# Altium schematic sheet 固定翼.SchDoc
size A4
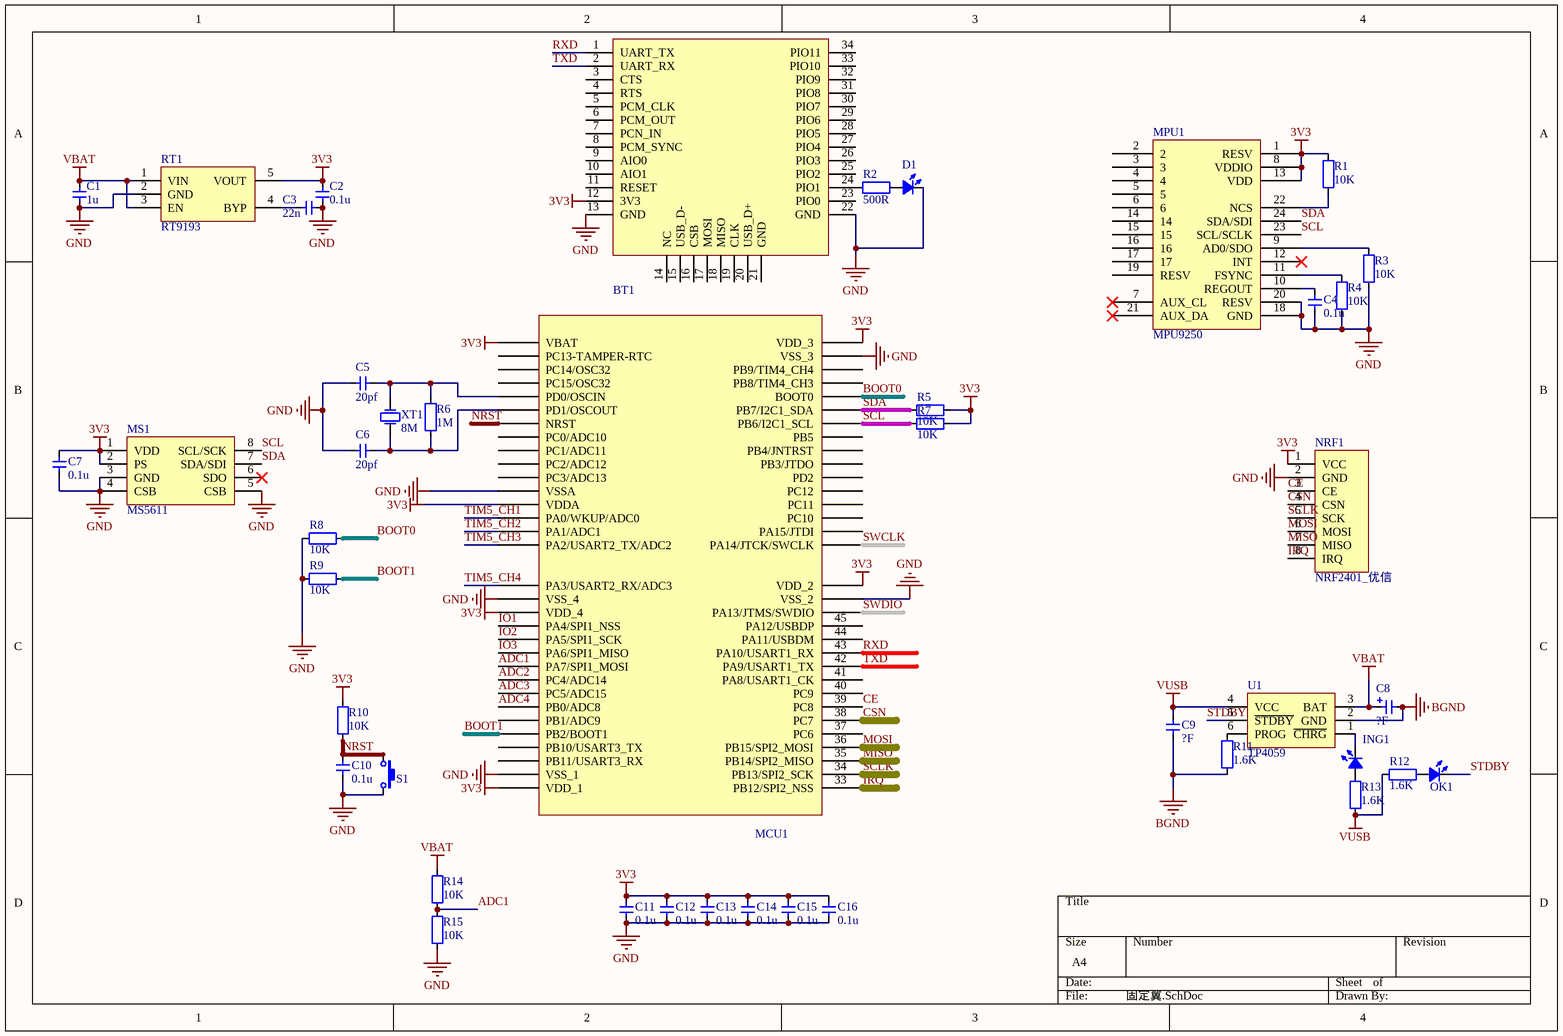
[diagram p0: 固定翼.SchDoc]

## Parts
BT1  Bluetooth_HC05  [Bluetooth_HC05]  (value not drawn)
C1  value 1u  [CAP_0603]  (hidden comment: Cap_0603)
C2  value 0.1u  [CAP_0603]  (hidden comment: Cap_0603)
C3  value 22n  [CAP_0603]  (hidden comment: Cap_0603)
C4  value 0.1u  [CAP_0603]  (hidden comment: Cap_0603)
C5  value 20pf  [CAP_0603]  (hidden comment: Cap_0603)
C6  value 20pf  [CAP_0603]  (hidden comment: Cap_0603)
C7  value 0.1u  [CAP_0603]  (hidden comment: Cap_0603)
C8  value ?F  [CAP_TAN_D2917]  (hidden comment: Cap_Tan_2917)
C9  value ?F  [CAP_0805]  (hidden comment: Cap_0805)
C10  value 0.1u  [CAP_0603]  (hidden comment: Cap_0603)
C11  value 0.1u  [CAP_0603]  (hidden comment: Cap_0603)
C12  value 0.1u  [CAP_0603]  (hidden comment: Cap_0603)
C13  value 0.1u  [CAP_0603]  (hidden comment: Cap_0603)
C14  value 0.1u  [CAP_0603]  (hidden comment: Cap_0603)
C15  value 0.1u  [CAP_0603]  (hidden comment: Cap_0603)
C16  value 0.1u  [CAP_0603]  (hidden comment: Cap_0603)
D1  LED_0805  [LED_0805_BLUE]  (value not drawn)
ING1  LED_0805  [LED_0805_RED]  (value not drawn)
MCU1  STM32F103RC  [LQFP_P0.5_64]  (value not drawn)
MPU1  MPU9250  [QFN_P0.4_24]
MS1  MS5611  [OTHER_MS5611_8]
NRF1  NRF2401_优信  [nrf24l01_youxin]
OK1  LED_0805  [LED_0805_GREEN]  (value not drawn)
R1  value 10K  [RES_0603]  (hidden comment: Res_0603)
R2  value 500R  [RES_0603]  (hidden comment: Res_0603)
R3  value 10K  [RES_0603]  (hidden comment: Res_0603)
R4  value 10K  [RES_0603]  (hidden comment: Res_0603)
R5  value 10K  [RES_0603]  (hidden comment: Res_0603)
R6  value 1M  [RES_0603]  (hidden comment: Res_0603)
R7  value 10K  [RES_0603]  (hidden comment: Res_0603)
R8  value 10K  [RES_0603]  (hidden comment: Res_0603)
R9  value 10K  [RES_0603]  (hidden comment: Res_0603)
R10  value 10K  [RES_0603]  (hidden comment: Res_0603)
R11  value 1.6K  [RES_0603]  (hidden comment: Res_0603)
R12  value 1.6K  [RES_0603]  (hidden comment: Res_0603)
R13  value 1.6K  [RES_0603]  (hidden comment: Res_0603)
R14  value 10K  [RES_0603]  (hidden comment: Res_0603)
R15  value 10K  [RES_0603]  (hidden comment: Res_0603)
RT1  RT9193  [SOT23-5]
S1  ButtonTACT_3x4x2_180  [ButtonTACT_3x4x2_180H]  (value not drawn)
U1  TP4059  [SOT23-6]
XT1  value 8M  [XT_5032_2]  (hidden comment: XTAL_5032_2P)

## Nets
3V3: BT1.12(3V3) C2.2 C7.2 C11.2 C12.2 C13.2 C14.2 C15.2 C16.2 MCU1.1(VBAT) MCU1.13(VDDA) MCU1.19(VDD_4) MCU1.32(VDD_1) MCU1.48(VDD_2) MCU1.64(VDD_3) MPU1.1(RESV) MPU1.8(VDDIO) MPU1.13(VDD) MS1.1(VDD) MS1.2(PS) NRF1.1(VCC) R1.1 R5.2 R7.2 R10.1 RT1.5(VOUT)
BGND: C8.2 C9.1 R11.2 U1.2(GND)
GND: BT1.13(GND) BT1.22(GND) C1.1 C2.1 C3.1 C4.2 C5.1 C6.1 C7.1 C10.1 C11.1 C12.1 C13.1 C14.1 C15.1 C16.1 D1.2(K) MCU1.12(VSSA) MCU1.18(VSS_4) MCU1.31(VSS_1) MCU1.47(VSS_2) MCU1.63(VSS_3) MPU1.18(GND) MPU1.20(RESV) MS1.3(GND) MS1.4(CSB) MS1.5(CSB) NRF1.2(GND) R3.2 R4.2 R8.2 R9.2 R15.1 RT1.2(GND) S1.2
VBAT: C1.2 C8.1 R14.2 RT1.1(VIN) RT1.3(EN) U1.3(BAT)
VUSB: C9.2 R12.1 R13.2 U1.4(VCC)
ADC1: MCU1.23(PA7/SPI1_MOSI) R14.1 R15.2
ADC2: MCU1.24(PC4/ADC14)
ADC3: MCU1.25(PC5/ADC15)
ADC4: MCU1.26(PB0/ADC8)
BOOT0: MCU1.60(BOOT0) R8.1
BOOT1: MCU1.28(PB2/BOOT1) R9.1
CE: MCU1.39(PC8) NRF1.3(CE)
CSN: MCU1.38(PC7) NRF1.4(CSN)
IO1: MCU1.20(PA4/SPI1_NSS)
IO2: MCU1.21(PA5/SPI1_SCK)
IO3: MCU1.22(PA6/SPI1_MISO)
IRQ: MCU1.33(PB12/SPI2_NSS) NRF1.8(IRQ)
MISO: MCU1.35(PB14/SPI2_MISO) NRF1.7(MISO)
MOSI: MCU1.36(PB15/SPI2_MOSI) NRF1.6(MOSI)
NRST: C10.2 MCU1.7(NRST) R10.2 S1.1
RXD: BT1.1(UART_TX) MCU1.43(PA10/USART1_RX)
SCL: MCU1.58(PB6/I2C1_SCL) MPU1.23(SCL/SCLK) MS1.8(SCL/SCK) R7.1
SCLK: MCU1.34(PB13/SPI2_SCK) NRF1.5(SCK)
SDA: MCU1.59(PB7/I2C1_SDA) MPU1.24(SDA/SDI) MS1.7(SDA/SDI) R5.1
STDBY: OK1.2(K) U1.5(~{STDBY})
SWCLK: MCU1.49(PA14/JTCK/SWCLK)
SWDIO: MCU1.46(PA13/JTMS/SWDIO)
TIM5_CH1: MCU1.14(PA0/WKUP/ADC0)
TIM5_CH2: MCU1.15(PA1/ADC1)
TIM5_CH3: MCU1.16(PA2/USART2_TX/ADC2)
TIM5_CH4: MCU1.17(PA3/USART2_RX/ADC3)
TXD: BT1.2(UART_RX) MCU1.42(PA9/USART1_TX)
NetBT1_24: BT1.24(PIO1) R2.1
NetC3_2: C3.2 RT1.4(BYP)
NetC4_1: C4.1 MPU1.10(REGOUT)
NetC5_2: C5.2 MCU1.5(PD0/OSCIN) R6.2 XT1.2(OSC2)
NetC6_2: C6.2 MCU1.6(PD1/OSCOUT) R6.1 XT1.1(OSC1)
NetD1_1: D1.1(A) R2.2
NetING1_1: ING1.1(A) R13.1
NetING1_2: ING1.2(K) U1.1(~{CHRG})
NetMPU1_9: MPU1.9(AD0/SDO) R3.1
NetMPU1_11: MPU1.11(FSYNC) R4.1
NetMPU1_22: MPU1.22(NCS) R1.2
NetOK1_1: OK1.1(A) R12.2
NetR11_1: R11.1 U1.6(PROG)

Not connected (* = marked no-connect by the designer): BT1 3(CTS) 4(RTS) 5(PCM_CLK) 6(PCM_OUT) 7(PCN_IN) 8(PCM_SYNC) 9(AIO0) 10(AIO1) 11(RESET) 14(NC) 15(USB_D-) 16(CSB) 17(MOSI) 18(MISO) 19(CLK) 20(USB_D+) 21(GND) 23(PIO0) 25(PIO2) 26(PIO3) 27(PIO4) 28(PIO5) 29(PIO6) 30(PIO7) 31(PIO8) 32(PIO9) 33(PIO10) 34(PIO11); MCU1 2(PC13-TAMPER-RTC) 3(PC14/OSC32) 4(PC15/OSC32) 8(PC0/ADC10) 9(PC1/ADC11) 10(PC2/ADC12) 11(PC3/ADC13) 27(PB1/ADC9) 29(PB10/USART3_TX) 30(PB11/USART3_RX) 37(PC6) 40(PC9) 41(PA8/USART1_CK) 44(PA11/USBDM) 45(PA12/USBDP) 50(PA15/JTDI) 51(PC10) 52(PC11) 53(PC12) 54(PD2) 55(PB3/JTDO) 56(PB4/JNTRST) 57(PB5) 61(PB8/TIM4_CH3) 62(PB9/TIM4_CH4); MPU1 2 3 4 5 6 7(AUX_CL)* 12(INT)* 14 15 16 17 19(RESV) 21(AUX_DA)*; MS1 6(SDO)*

## Library data of the parts
BT1 = Bluetooth_HC05: Module
C1-C7 C10-C16 = Cap_0603: Capacitor
C8 = Cap_Tan_2917: Capacitor
C9 = Cap_0805: Capacitor
D1 ING1 OK1 = LED_0805: LED
MCU1 = STM32F103RC: MCU
MS1 = MS5611: Sensor
R1-R15 = Res_0603: Resistor
RT1 = RT9193: Power
S1 = ButtonTACT_3x4x2_180: Button
XT1 = XTAL_5032_2P: Crystal Oscillator